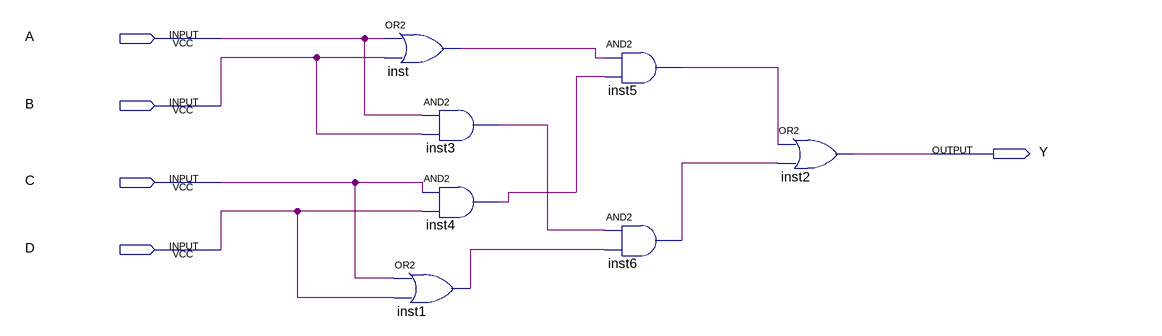
[diagram p0: schematic sheet]
// Quartus schematic lab1.bdf as structural Verilog: 7 symbols, 5 pins
module lab1 (
  input  A,
  input  B,
  input  C,
  input  D,
  output Y
);

  wire inst1_out, inst3_out, inst4_out, inst5_out, inst6_out, inst_out;

  or inst (inst_out, A, B);
  or inst1 (inst1_out, C, D);
  and inst3 (inst3_out, A, B);
  and inst4 (inst4_out, C, D);
  and inst5 (inst5_out, inst_out, inst4_out);
  and inst6 (inst6_out, inst3_out, inst1_out);
  or inst2 (Y, inst5_out, inst6_out);
endmodule
